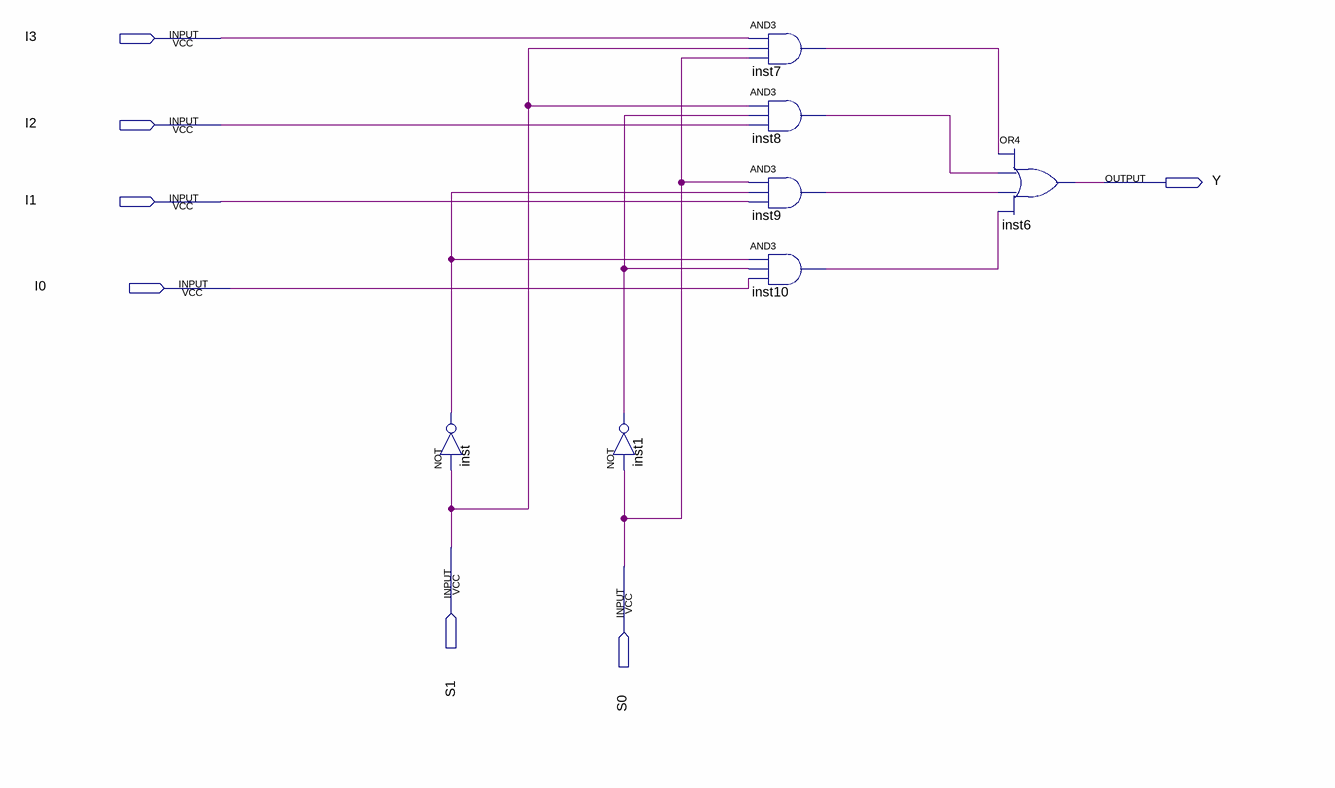
[diagram p0: schematic sheet]
// Quartus schematic mux4to1.bdf as structural Verilog: 7 symbols, 7 pins
module mux4to1 (
  input  I3,
  input  I2,
  input  I1,
  input  I0,
  input  S1,
  input  S0,
  output Y
);

  wire inst1_out, inst7_out, inst8_out, inst9_out, inst10_out, inst_out;

  not inst (inst_out, S1);
  not inst1 (inst1_out, S0);
  and inst7 (inst7_out, I3, S1, S0);
  and inst8 (inst8_out, S1, inst1_out, I2);
  and inst9 (inst9_out, S0, inst_out, I1);
  and inst10 (inst10_out, inst_out, inst1_out, I0);
  or inst6 (Y, inst7_out, inst8_out, inst9_out, inst10_out);
endmodule
